# EAGLE design servo_power (EAGLE 9.6.2)

## Sheet 1 of 2
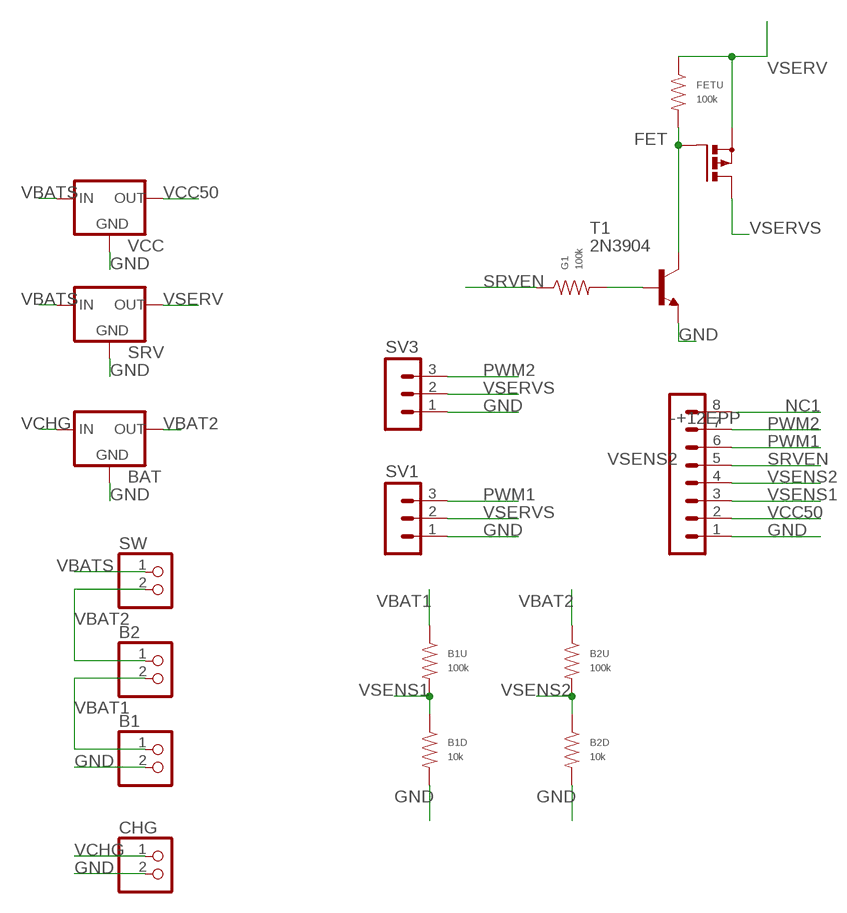
[diagram p0: schematic, sheet 1]

### Parts
-+12EPP  MA08-1  [MA08-1]
B1  PINHD-1X2  [1X02]
B1D  10k  RESISTOR_1206  [R1206]
B1U  100k  RESISTOR_1206  [R1206]
B2  PINHD-1X2  [1X02]
B2D  10k  RESISTOR_1206  [R1206]
B2U  100k  RESISTOR_1206  [R1206]
BAT  78XXS  [78XXS]
CHG  PINHD-1X2  [1X02]
FET  PMOSFET_PTO220BV  [TO220BV]
FETU  100k  RESISTOR_1206  [R1206]
G1  100k  RESISTOR_1206  [R1206]
SRV  78XXS  [78XXS]
SV1  MA03-1  [MA03-1]
SV3  MA03-1  [MA03-1]
SW  PINHD-1X2  [1X02]
T1  2N3904  [TO92]
VCC  78XXS  [78XXS]

### Nets
GND: -+12EPP.1 B1.2 B1D.P$2 B2D.P$2 BAT.GND CHG.2 SRV.GND SV1.1 SV3.1 T1.3(E) VCC.GND
N$13: G1.P$2 T1.2(B)
N$15: FET.G FETU.P$2 T1.1(C)
NC1: -+12EPP.8
PWM1: -+12EPP.6 SV1.3
PWM2: -+12EPP.7 SV3.3
SRVEN: -+12EPP.5 G1.P$1
VBAT1: B1.1 B1U.P$1 B2.2
VBAT2: B2.1 B2U.P$1 BAT.OUT SW.2
VBATS: SRV.IN SW.1 VCC.IN
VCC50: -+12EPP.2 VCC.OUT
VCHG: BAT.IN CHG.1
VSENS1: -+12EPP.3 B1D.P$1 B1U.P$2
VSENS2: -+12EPP.4 B2D.P$1 B2U.P$2
VSERV: FET.S FETU.P$1 SRV.OUT
VSERVS: FET.D SV1.2 SV3.2

## Sheet 2 of 2

## Library data of the parts
-+12EPP = con-lstb:MA08-1: PIN HEADER; OC_FARNELL: unknown; OC_NEWARK: unknown
B1 B2 CHG SW = pinhead:PINHD-1X2: PIN HEADER
B1D B1U B2D B2U FETU G1 = 00jim:RESISTOR: Library: MF_Passives Description: Device for Resistors. Manufacture part number (MPN), Voltage, Tolerance, and Wattage Rating can be added via Attributes. Check https://factory.macrofab.com/parts for the house parts list.; POPULATE: 1
BAT SRV VCC = v-reg:78XXS: VOLTAGE REGULATOR
FET = transistor-power:PMOSFET_P: Power MOSFET P-Channel
SV1 SV3 = con-lstb:MA03-1: PIN HEADER; OC_FARNELL: unknown; OC_NEWARK: unknown
T1 = transistor:2N3904: NPN TRANSISTOR

## Board
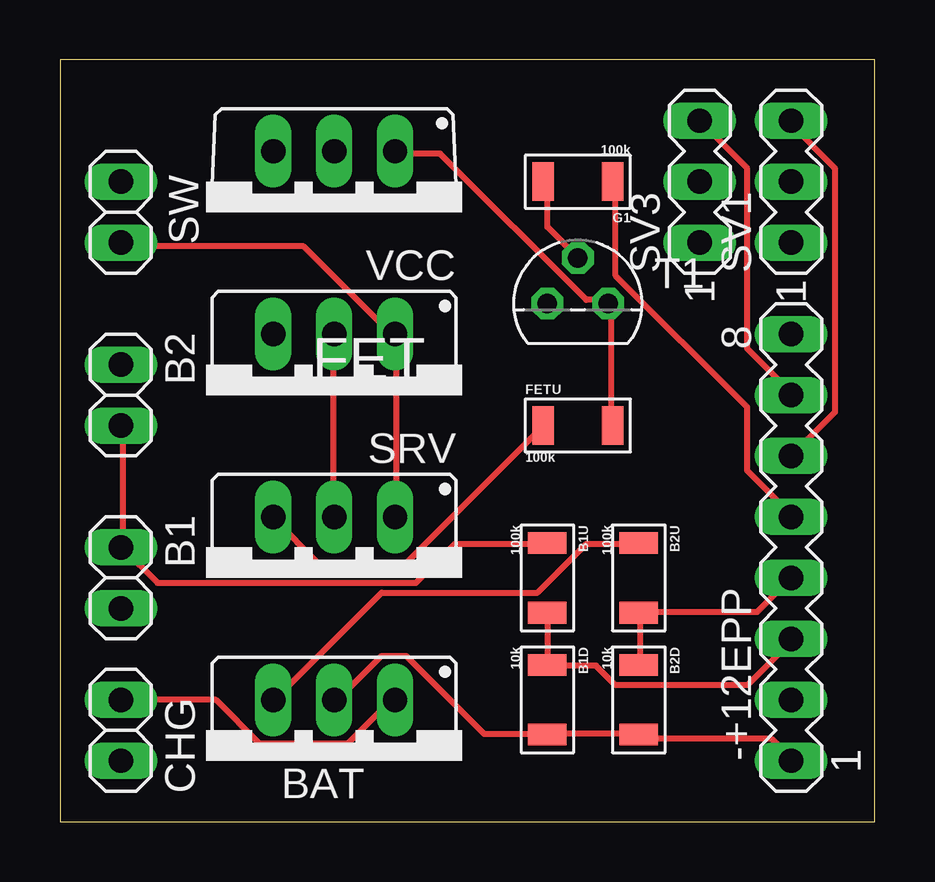
[diagram p1: board, top side]
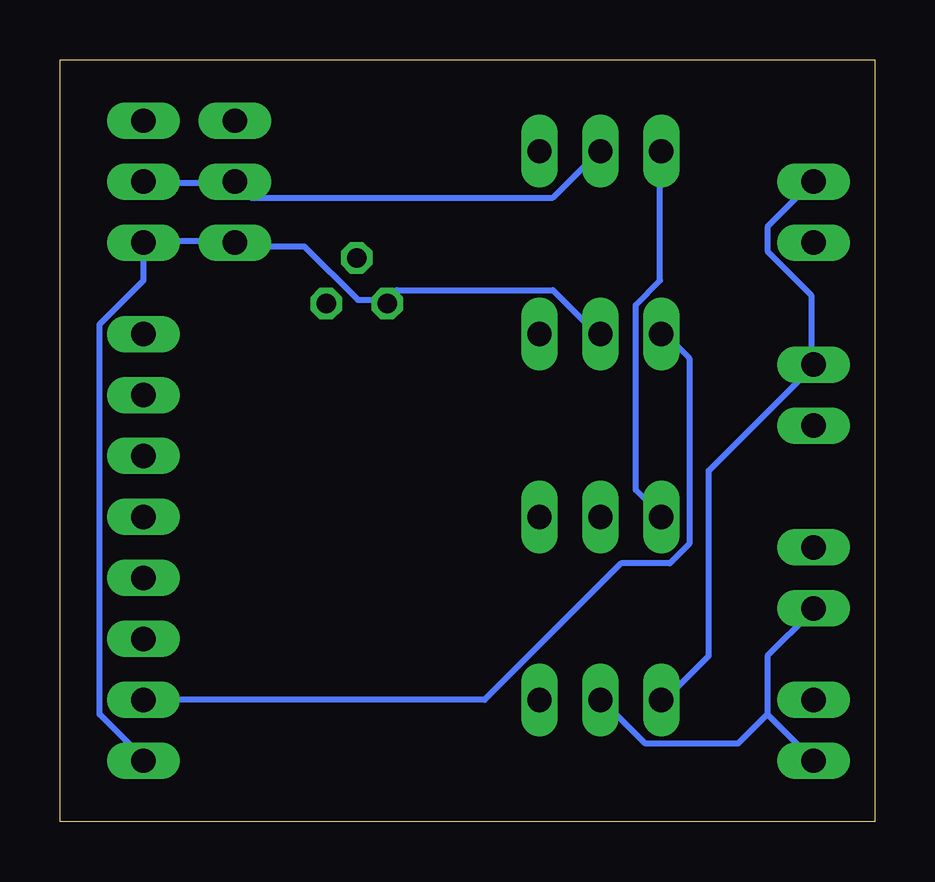
[diagram p2: board, bottom side, seen from below]

Size 33.96 x 31.74 mm. Coordinates in mm from the lower left corner, seen from the top.
Outline: 0,0 33.96,0 33.96,31.74 0,31.74 0,0
Copper layers (1*16): Top 0.035mm / dielectric 1.5mm / Bottom 0.035mm
Design rules "default *": minimum track width 10mil, minimum drill 0.35mm, track to track 6mil, track to pad 6mil, pad to pad 6mil, via to via 6mil, smd to smd 6mil, copper to edge 40mil, drill to drill 6mil, minimum pad ring 10mil, minimum via ring 8mil, stop-mask expansion 4mil, vias tented up to drill 0mil, thermal gap 10mil

### Footprints (pad centres in the part's own frame; a part is rotated, then mirrored left to right if it is on the bottom)
MA08-1 = drill 1.016 long: 1 -8.89,0; 2 -6.35,0; 3 -3.81,0; 4 -1.27,0; 5 1.27,0; 6 3.81,0; 7 6.35,0; 8 8.89,0
1X02 = drill 1.016 long: 1 -1.27,0; 2 1.27,0
R1206 = smd 0.9 x 1.6: P$1 -1.45,0; P$2 1.45,0
78XXS = drill 1.016 long: GND 0,-2.54; IN -2.54,-2.54; OUT 2.54,-2.54
TO220BV = drill 1.016 long: D 0,-2.54; G -2.54,-2.54; S 2.54,-2.54
MA03-1 = drill 1.016 long: 1 -2.54,0; 2 0,0; 3 2.54,0
TO92 = drill 0.813 octagon: 1 1.27,0; 2 0,1.905; 3 -1.27,0

### Placement (x,y rotation side)
-+12EPP  30.48,11.43 90 top
B1  2.54,10.16 270 top
B1D  20.32,5.08 270 top
B1U  20.32,10.16 270 top
B2  2.54,17.78 270 top
B2D  24.13,5.08 270 top
B2U  24.13,10.16 270 top
BAT  11.43,2.54 180 top
CHG  2.54,3.81 270 top
FET  11.43,25.4 180 top
FETU  21.59,16.51 0 top
G1  21.59,26.67 180 top
SRV  11.43,10.16 180 top
SV1  30.48,26.67 90 top
SV3  26.67,26.67 90 top
SW  2.54,25.4 90 top
T1  21.59,21.59 0 top
VCC  11.43,17.78 180 top

### Tracks (layer width: path | path; a pad name or v marks a point on that pad's centre or on a via)
GND
  Top 0.254: SRV.GND 11.38,12.8 11.38,20.32 VCC.GND | 20.32,3.66 23.98,3.66 B2D.P$2 24.18,3.45 29.67,3.45 30.48,2.64 -+12EPP.1 | 20.32,3.66 17.68,3.66 14.43,6.91 13.41,6.91 11.58,5.08 BAT.GND | 20.32,3.66 B1D.P$2
  Bottom 0.254: 20.32,21.74 21.54,21.74 23.77,23.98 26.62,23.98 SV3.1 26.82,24.18 30.48,24.18 SV1.1 30.48,22.55 32.31,20.73 32.31,4.47 30.48,2.64 -+12EPP.1 | 20.32,21.74 19.91,22.15 13.41,22.15 11.58,20.32 VCC.GND | 20.32,21.74 T1.3 | 4.47,4.47 CHG.2 | 4.47,4.47 4.47,6.91 2.64,8.74 B1.2 | 4.47,4.47 5.69,3.25 9.55,3.25 11.38,5.08 BAT.GND
N$13
  Top 0.254: G1.P$2 20.32,26.62 20.32,24.79 21.54,23.57 T1.2
N$15
  Top 0.254: FETU.P$2 22.96,16.66 22.96,21.54 T1.1 22.76,21.74 21.95,21.74 15.85,27.84 14.02,27.84 FET.G
PWM1
  Top 0.254: -+12EPP.6 32.31,17.07 32.31,27.23 30.48,29.06 SV1.3
PWM2
  Top 0.254: SV3.3 28.65,27.23 28.65,19.71 30.48,17.88 -+12EPP.7
SRVEN
  Top 0.254: G1.P$1 23.16,26.62 23.16,22.76 28.65,17.27 28.65,14.63 30.48,12.8 -+12EPP.5
VBAT1
  Top 0.254: B1U.P$1 20.32,11.58 16.46,11.58 14.83,9.96 4.06,9.96 2.64,11.38 B1.1 2.64,11.58 2.64,16.46 B2.2
VBAT2
  Top 0.254: B2U.P$1 23.98,11.58 21.95,11.58 19.91,9.55 13.41,9.55 8.94,5.08 BAT.OUT
  Bottom 0.254: SW.2 2.64,26.62 4.47,24.79 4.47,23.77 2.64,21.95 2.64,19.1 B2.1 2.64,18.9 6.91,14.63 6.91,6.91 8.74,5.08 BAT.OUT
VBATS
  Top 0.254: SRV.IN 14.02,12.8 14.02,20.32 VCC.IN 13.82,20.32 10.16,23.98 2.64,23.98 SW.1
VCC50
  Bottom 0.254: -+12EPP.2 16.26,5.08 10.57,10.77 8.53,10.77 7.72,11.58 7.72,19.3 8.74,20.32 VCC.OUT
VCHG
  Top 0.254: CHG.1 6.5,5.08 8.33,3.25 11.99,3.25 13.82,5.08 BAT.IN
VSENS1
  Top 0.254: B1U.P$2 B1D.P$1 20.32,6.5 22.35,6.5 23.16,5.69 28.65,5.69 30.48,7.52 -+12EPP.3
VSENS2
  Top 0.254: B2D.P$1 24.18,6.71 24.18,8.53 B2U.P$2 24.18,8.74 29.06,8.74 -+12EPP.4
VSERV
  Top 0.254: FETU.P$1 20.12,16.46 14.43,10.77 10.77,10.77 8.94,12.6 SRV.OUT
  Bottom 0.254: FET.S 8.94,27.84 8.94,22.55 9.96,21.54 9.96,13.82 8.94,12.8 SRV.OUT
VSERVS
  Bottom 0.254: SV1.2 30.48,26.62 26.82,26.62 SV3.2 26.01,26.01 13.41,26.01 11.58,27.84 FET.D